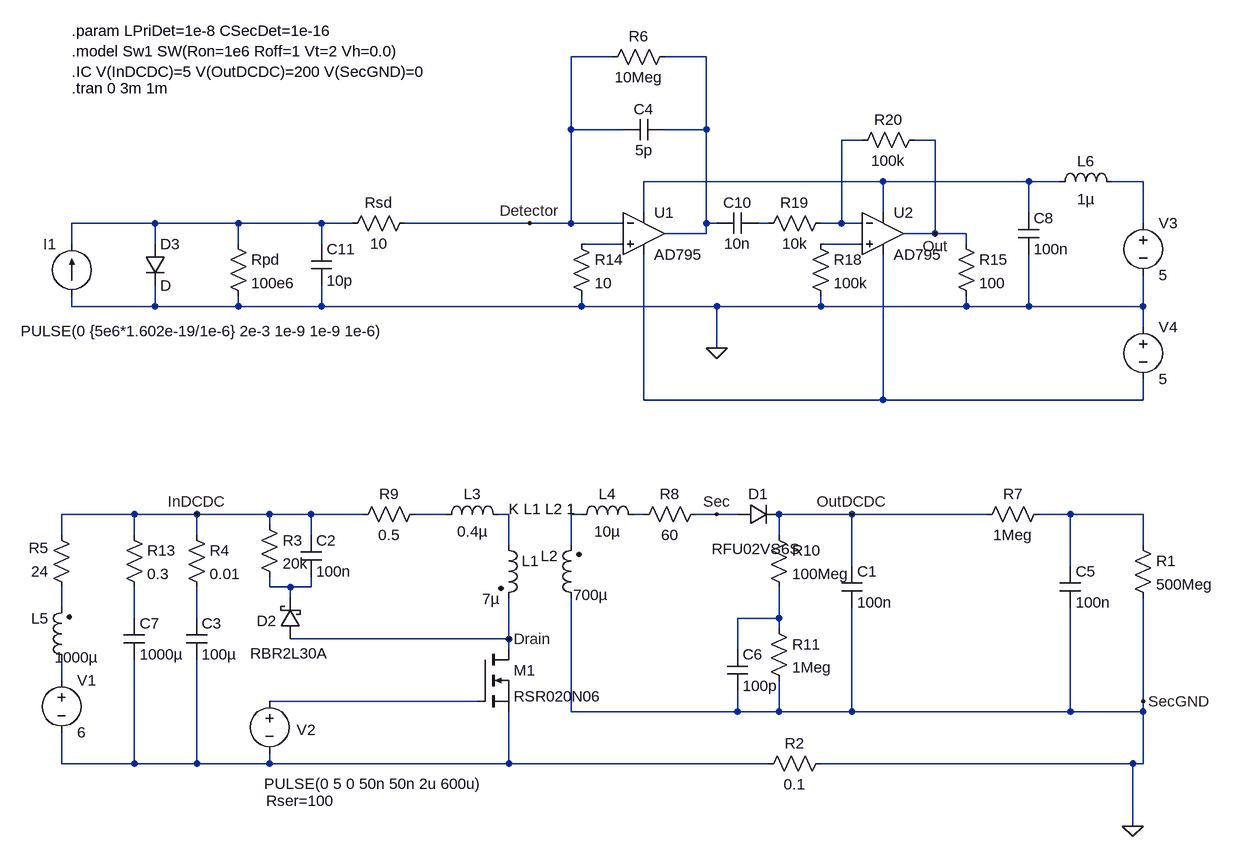
[diagram p0: schematic Lab3a.asc]
Lab3a.asc, the LTspice schematic file:
Version 4
SHEET 1 1852 704
WIRE 416 -576 352 -576
WIRE 560 -576 496 -576
WIRE 352 -464 352 -576
WIRE 432 -464 352 -464
WIRE 560 -464 560 -576
WIRE 560 -464 496 -464
WIRE 800 -448 768 -448
WIRE 912 -448 880 -448
WIRE 832 -384 464 -384
WIRE 1056 -384 832 -384
WIRE 1104 -384 1056 -384
WIRE 1232 -384 1184 -384
WIRE 464 -336 464 -384
WIRE 832 -336 832 -384
WIRE 1056 -336 1056 -384
WIRE -288 -320 -416 -320
WIRE -160 -320 -288 -320
WIRE -32 -320 -160 -320
WIRE 16 -320 -32 -320
WIRE 288 -320 96 -320
WIRE 352 -320 352 -464
WIRE 352 -320 288 -320
WIRE 432 -320 352 -320
WIRE 560 -320 560 -464
WIRE 576 -320 560 -320
WIRE 656 -320 640 -320
WIRE 768 -320 768 -448
WIRE 768 -320 736 -320
WIRE 800 -320 768 -320
WIRE 1232 -320 1232 -384
WIRE 560 -304 560 -320
WIRE 560 -304 496 -304
WIRE 912 -304 912 -448
WIRE 912 -304 864 -304
WIRE 960 -304 912 -304
WIRE -416 -288 -416 -320
WIRE -288 -288 -288 -320
WIRE -160 -288 -160 -320
WIRE -32 -288 -32 -320
WIRE 432 -288 368 -288
WIRE 800 -288 736 -288
WIRE 960 -288 960 -304
WIRE -416 -192 -416 -208
WIRE -288 -192 -288 -224
WIRE -288 -192 -416 -192
WIRE -160 -192 -160 -208
WIRE -160 -192 -288 -192
WIRE -32 -192 -32 -224
WIRE -32 -192 -160 -192
WIRE 368 -192 368 -208
WIRE 368 -192 -32 -192
WIRE 576 -192 368 -192
WIRE 736 -192 736 -208
WIRE 736 -192 576 -192
WIRE 960 -192 960 -208
WIRE 960 -192 736 -192
WIRE 1056 -192 1056 -272
WIRE 1056 -192 960 -192
WIRE 1232 -192 1232 -240
WIRE 1232 -192 1056 -192
WIRE 1232 -160 1232 -192
WIRE 576 -128 576 -192
WIRE 464 -48 464 -272
WIRE 832 -48 832 -272
WIRE 832 -48 464 -48
WIRE 1232 -48 1232 -80
WIRE 1232 -48 832 -48
WIRE -320 128 -432 128
WIRE -224 128 -320 128
WIRE -112 128 -224 128
WIRE -48 128 -112 128
WIRE 32 128 -48 128
WIRE 160 128 112 128
WIRE 256 128 240 128
WIRE 368 128 352 128
WIRE 464 128 448 128
WIRE 576 128 544 128
WIRE 608 128 576 128
WIRE 784 128 672 128
WIRE 992 128 784 128
WIRE 1120 128 1072 128
WIRE 1232 128 1120 128
WIRE -112 144 -112 128
WIRE -432 160 -432 128
WIRE -320 160 -320 128
WIRE -224 160 -224 128
WIRE -48 160 -48 128
WIRE 672 160 672 128
WIRE 256 176 256 128
WIRE 352 176 352 128
WIRE 1232 176 1232 128
WIRE 784 208 784 128
WIRE 1120 208 1120 128
WIRE -112 240 -112 224
WIRE -80 240 -112 240
WIRE -48 240 -48 224
WIRE -48 240 -80 240
WIRE -80 256 -80 240
WIRE -432 272 -432 240
WIRE -320 288 -320 240
WIRE -224 288 -224 240
WIRE 672 288 672 240
WIRE 672 288 608 288
WIRE 672 304 672 288
WIRE 256 320 256 256
WIRE 256 320 -80 320
WIRE 256 336 256 320
WIRE 608 336 608 288
WIRE -432 384 -432 352
WIRE 208 416 -112 416
WIRE 1232 416 1232 256
WIRE 352 432 352 256
WIRE 608 432 608 400
WIRE 608 432 352 432
WIRE 672 432 672 384
WIRE 672 432 608 432
WIRE 784 432 784 272
WIRE 784 432 672 432
WIRE 1120 432 1120 272
WIRE 1120 432 784 432
WIRE 1232 432 1232 416
WIRE 1232 432 1120 432
WIRE -432 512 -432 464
WIRE -320 512 -320 352
WIRE -320 512 -432 512
WIRE -224 512 -224 352
WIRE -224 512 -320 512
WIRE -112 512 -112 496
WIRE -112 512 -224 512
WIRE 256 512 256 432
WIRE 256 512 -112 512
WIRE 656 512 256 512
WIRE 1216 512 736 512
WIRE 1232 512 1232 432
WIRE 1232 512 1216 512
WIRE 1216 608 1216 512
FLAG 1216 608 0
FLAG 1232 416 SecGND
FLAG 576 -128 0
FLAG 256 320 Drain
FLAG 576 128 Sec
FLAG 912 -304 Out
FLAG -224 128 InDCDC
FLAG 784 128 OutDCDC
FLAG 288 -320 Detector
SYMBOL ind2 240 160 R0
WINDOW 3 -25 98 Left 2
SYMATTR Value 7µ
SYMATTR InstName L1
SYMATTR Type ind
SYMBOL ind2 368 272 R180
WINDOW 0 36 80 Left 2
WINDOW 3 -41 20 Left 2
SYMATTR InstName L2
SYMATTR Value 700µ
SYMATTR Type ind
SYMBOL nmos 208 336 R0
SYMATTR InstName M1
SYMATTR Value RSR020N06
SYMBOL diode 608 144 R270
WINDOW 0 32 32 VTop 2
WINDOW 3 -22 29 VBottom 2
SYMATTR InstName D1
SYMATTR Value RFU02VS6S
SYMBOL cap 768 208 R0
SYMATTR InstName C1
SYMATTR Value 100n
SYMATTR SpiceLine Rser=0.1
SYMBOL voltage -432 368 R0
WINDOW 123 0 0 Left 2
WINDOW 39 0 0 Left 2
SYMATTR InstName V1
SYMATTR Value 6
SYMBOL voltage -112 400 R0
WINDOW 123 0 0 Left 2
WINDOW 39 -5 169 Left 2
WINDOW 0 42 60 Left 2
WINDOW 3 -8 143 Left 2
SYMATTR SpiceLine Rser=100
SYMATTR InstName V2
SYMATTR Value PULSE(0 5 0 50n 50n 2u 600u)
SYMBOL res 1216 160 R0
SYMATTR InstName R1
SYMATTR Value 500Meg
SYMBOL res 752 496 R90
WINDOW 0 0 56 VBottom 2
WINDOW 3 32 56 VTop 2
SYMATTR InstName R2
SYMATTR Value 0.1
SYMBOL schottky -64 320 R180
WINDOW 0 37 28 Left 2
WINDOW 3 -42 -22 Left 2
SYMATTR InstName D2
SYMATTR Value RBR2L30A
SYMATTR Description Diode
SYMATTR Type diode
SYMBOL res -128 128 R0
SYMATTR InstName R3
SYMATTR Value 20k
SYMBOL cap -64 160 R0
SYMATTR InstName C2
SYMATTR Value 100n
SYMATTR SpiceLine Rser=0.01
SYMBOL cap -240 288 R0
SYMATTR InstName C3
SYMATTR Value 100µ
SYMBOL res -240 144 R0
SYMATTR InstName R4
SYMATTR Value 0.01
SYMBOL res -416 256 R180
WINDOW 0 36 76 Left 2
WINDOW 3 36 40 Left 2
SYMATTR InstName R5
SYMATTR Value 24
SYMBOL res 1088 112 R90
WINDOW 0 0 56 VBottom 2
WINDOW 3 32 56 VTop 2
SYMATTR InstName R7
SYMATTR Value 1Meg
SYMBOL cap 1104 208 R0
SYMATTR InstName C5
SYMATTR Value 100n
SYMATTR SpiceLine Rser=0.1
SYMBOL ind 256 144 M270
WINDOW 0 32 56 VTop 2
WINDOW 3 5 56 VBottom 2
SYMATTR InstName L3
SYMATTR Value 0.4µ
SYMBOL res 560 112 R90
WINDOW 0 0 56 VBottom 2
WINDOW 3 32 56 VTop 2
SYMATTR InstName R8
SYMATTR Value 60
SYMBOL res 128 112 R90
WINDOW 0 0 56 VBottom 2
WINDOW 3 32 56 VTop 2
SYMATTR InstName R9
SYMATTR Value 0.5
SYMBOL res 656 144 R0
SYMATTR InstName R10
SYMATTR Value 100Meg
SYMBOL res 656 288 R0
SYMATTR InstName R11
SYMATTR Value 1Meg
SYMBOL cap 592 336 R0
SYMATTR InstName C6
SYMATTR Value 100p
SYMBOL ind 464 144 M270
WINDOW 0 32 56 VTop 2
WINDOW 3 5 56 VBottom 2
SYMATTR InstName L4
SYMATTR Value 10µ
SYMBOL cap -336 288 R0
SYMATTR InstName C7
SYMATTR Value 1000µ
SYMBOL res -336 144 R0
SYMATTR InstName R13
SYMATTR Value 0.3
SYMBOL ind2 -416 368 R180
WINDOW 0 36 80 Left 2
WINDOW 3 -41 20 Left 2
SYMATTR InstName L5
SYMATTR Value 1000µ
SYMATTR Type ind
SYMBOL Opamps\\AD795 464 -368 R0
SYMATTR InstName U1
SYMBOL cap 496 -480 R90
WINDOW 0 0 32 VBottom 2
WINDOW 3 32 32 VTop 2
SYMATTR InstName C4
SYMATTR Value 5p
SYMBOL res 512 -592 R90
WINDOW 0 0 56 VBottom 2
WINDOW 3 32 56 VTop 2
SYMATTR InstName R6
SYMATTR Value 10Meg
SYMBOL cap 1040 -336 R0
SYMATTR InstName C8
SYMATTR Value 100n
SYMATTR SpiceLine Rser=0,1
SYMBOL voltage 1232 -336 R0
WINDOW 123 0 0 Left 2
WINDOW 39 0 0 Left 2
SYMATTR InstName V3
SYMATTR Value 5
SYMBOL ind 1088 -368 R270
WINDOW 0 32 56 VTop 2
WINDOW 3 5 56 VBottom 2
SYMATTR InstName L6
SYMATTR Value 1µ
SYMBOL res 352 -304 R0
SYMATTR InstName R14
SYMATTR Value 10
SYMBOL current -416 -208 R180
WINDOW 0 24 80 Left 2
WINDOW 3 -489 -54 Left 2
WINDOW 123 0 0 Left 2
WINDOW 39 0 0 Left 2
SYMATTR InstName I1
SYMATTR Value PULSE(0 {5e6*1.602e-19/1e-6} 2e-3 1e-9 1e-9 1e-6)
SYMBOL res 944 -304 R0
SYMATTR InstName R15
SYMATTR Value 100
SYMBOL Opamps\\AD795 832 -368 R0
SYMATTR InstName U2
SYMBOL res 720 -304 R0
SYMATTR InstName R18
SYMATTR Value 100k
SYMBOL cap 640 -336 R90
WINDOW 0 0 32 VBottom 2
WINDOW 3 32 32 VTop 2
SYMATTR InstName C10
SYMATTR Value 10n
SYMBOL res 752 -336 R90
WINDOW 0 0 56 VBottom 2
WINDOW 3 32 56 VTop 2
SYMATTR InstName R19
SYMATTR Value 10k
SYMBOL res 896 -464 R90
WINDOW 0 0 56 VBottom 2
WINDOW 3 32 56 VTop 2
SYMATTR InstName R20
SYMATTR Value 100k
SYMBOL voltage 1232 -176 R0
WINDOW 123 0 0 Left 2
WINDOW 39 0 0 Left 2
SYMATTR InstName V4
SYMATTR Value 5
SYMBOL res -176 -304 R0
SYMATTR InstName Rpd
SYMATTR Value 100e6
SYMBOL diode -304 -288 R0
SYMATTR InstName D3
SYMBOL cap -48 -288 R0
SYMATTR InstName C11
SYMATTR Value 10p
SYMBOL res 112 -336 R90
WINDOW 0 0 56 VBottom 2
WINDOW 3 32 56 VTop 2
SYMATTR InstName Rsd
SYMATTR Value 10
TEXT 256 120 Left 2 !K L1 L2 1
TEXT -416 -528 Left 2 !.tran 0 3m 1m
TEXT -416 -616 Left 2 !.param LPriDet=1e-8 CSecDet=1e-16\n.model Sw1 SW(Ron=1e6 Roff=1 Vt=2 Vh=0.0)\n.IC V(InDCDC)=5 V(OutDCDC)=200 V(SecGND)=0

The netlist it stands for:
* Lab3a.asc
L1 N011 Drain 7µ
L2 0 N012 700µ
M1 Drain N021 N022 N022 RSR020N06
D1 Sec OutDCDC RFU02VS6S
C1 OutDCDC 0 100n Rser=0.1
V1 N020 N022 6
V2 N021 N022 PULSE(0 5 0 50n 50n 2u 600u) Rser=100
R1 N014 0 500Meg
R2 0 N022 0.1
D2 Drain N015 RBR2L30A
R3 InDCDC N015 20k
C2 InDCDC N015 100n Rser=0.01
C3 N018 N022 100µ
R4 InDCDC N018 0.01
R5 N016 InDCDC 24
R7 N014 OutDCDC 1Meg
C5 N014 0 100n Rser=0.1
L3 N011 N010 0.4µ
R8 Sec N013 60
R9 N010 InDCDC 0.5
R10 OutDCDC N019 100Meg
R11 N019 0 1Meg
C6 N019 0 100p
L4 N013 N012 10µ
C7 N017 N022 1000µ
R13 InDCDC N017 0.3
L5 N020 N016 1000µ
XU1 N007 Detector N003 N009 N001 AD795  ; pins In+ In- V+ V- OUT
C4 N001 Detector 5p
R6 N001 Detector 10Meg
C8 N003 0 100n Rser=0,1
V3 N004 0 5
L6 N003 N004 1µ
R14 N007 0 10
I1 0 N005 PULSE(0 {5e6*1.602e-19/1e-6} 2e-3 1e-9 1e-9 1e-6)
R15 Out 0 100
XU2 N008 N002 N003 N009 Out AD795  ; pins In+ In- V+ V- OUT
R18 N008 0 100k
C10 N006 N001 10n
R19 N002 N006 10k
R20 Out N002 100k
V4 0 N009 5
Rpd N005 0 100e6
D3 N005 0 D
C11 N005 0 10p
Rsd Detector N005 10
.model D D
.lib standard.dio
.model NMOS NMOS
.model PMOS PMOS
.lib standard.mos
K L1 L2 1
.tran 0 3m 1m
.param LPriDet=1e-8 CSecDet=1e-16
.model Sw1 SW(Ron=1e6 Roff=1 Vt=2 Vh=0.0)
.IC V(InDCDC)=5 V(OutDCDC)=200 V(SecGND)=0
.lib ADI1.lib
.backanno
.end